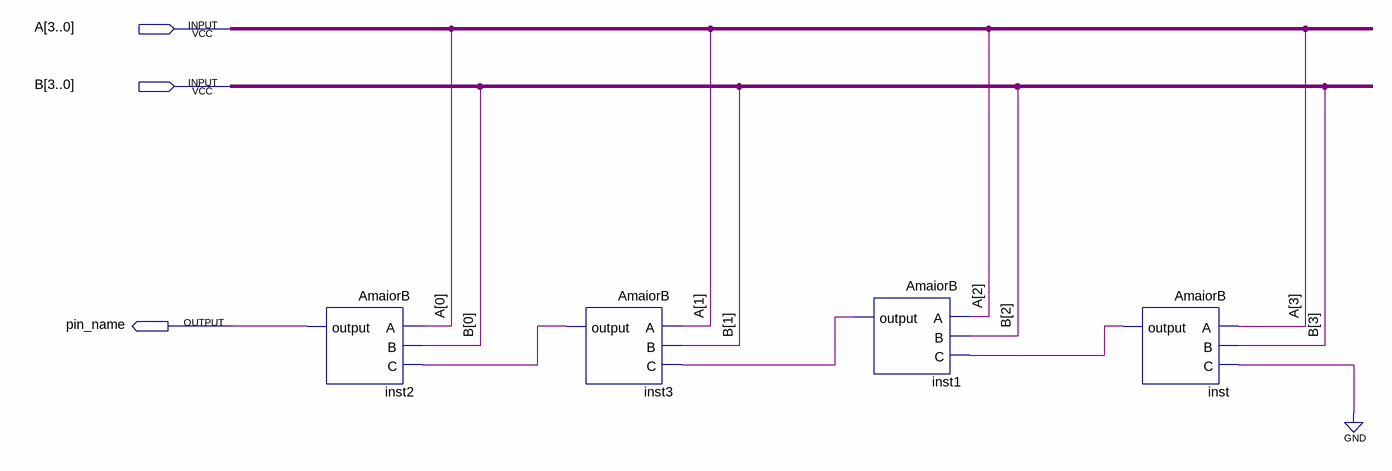
[diagram p0: schematic sheet]
// Quartus schematic AmaiorB4Bits.bdf as structural Verilog: 4 symbols, 3 pins
module AmaiorB4Bits (
  input  [3:0] A,
  input  [3:0] B,
  output pin_name
);

  wire inst1_output, inst3_output, inst_output;

  AmaiorB inst2 (.A(A[0]), .B(B[0]), .C(inst3_output), .\output (pin_name));
  AmaiorB inst3 (.A(A[1]), .B(B[1]), .C(inst1_output), .\output (inst3_output));
  AmaiorB inst1 (.A(A[2]), .B(B[2]), .C(inst_output), .\output (inst1_output));
  AmaiorB inst (.A(A[3]), .B(B[3]), .C(1'b0), .\output (inst_output));
endmodule
